# EAGLE schematic motor_controller_logic (EAGLE 6.1)
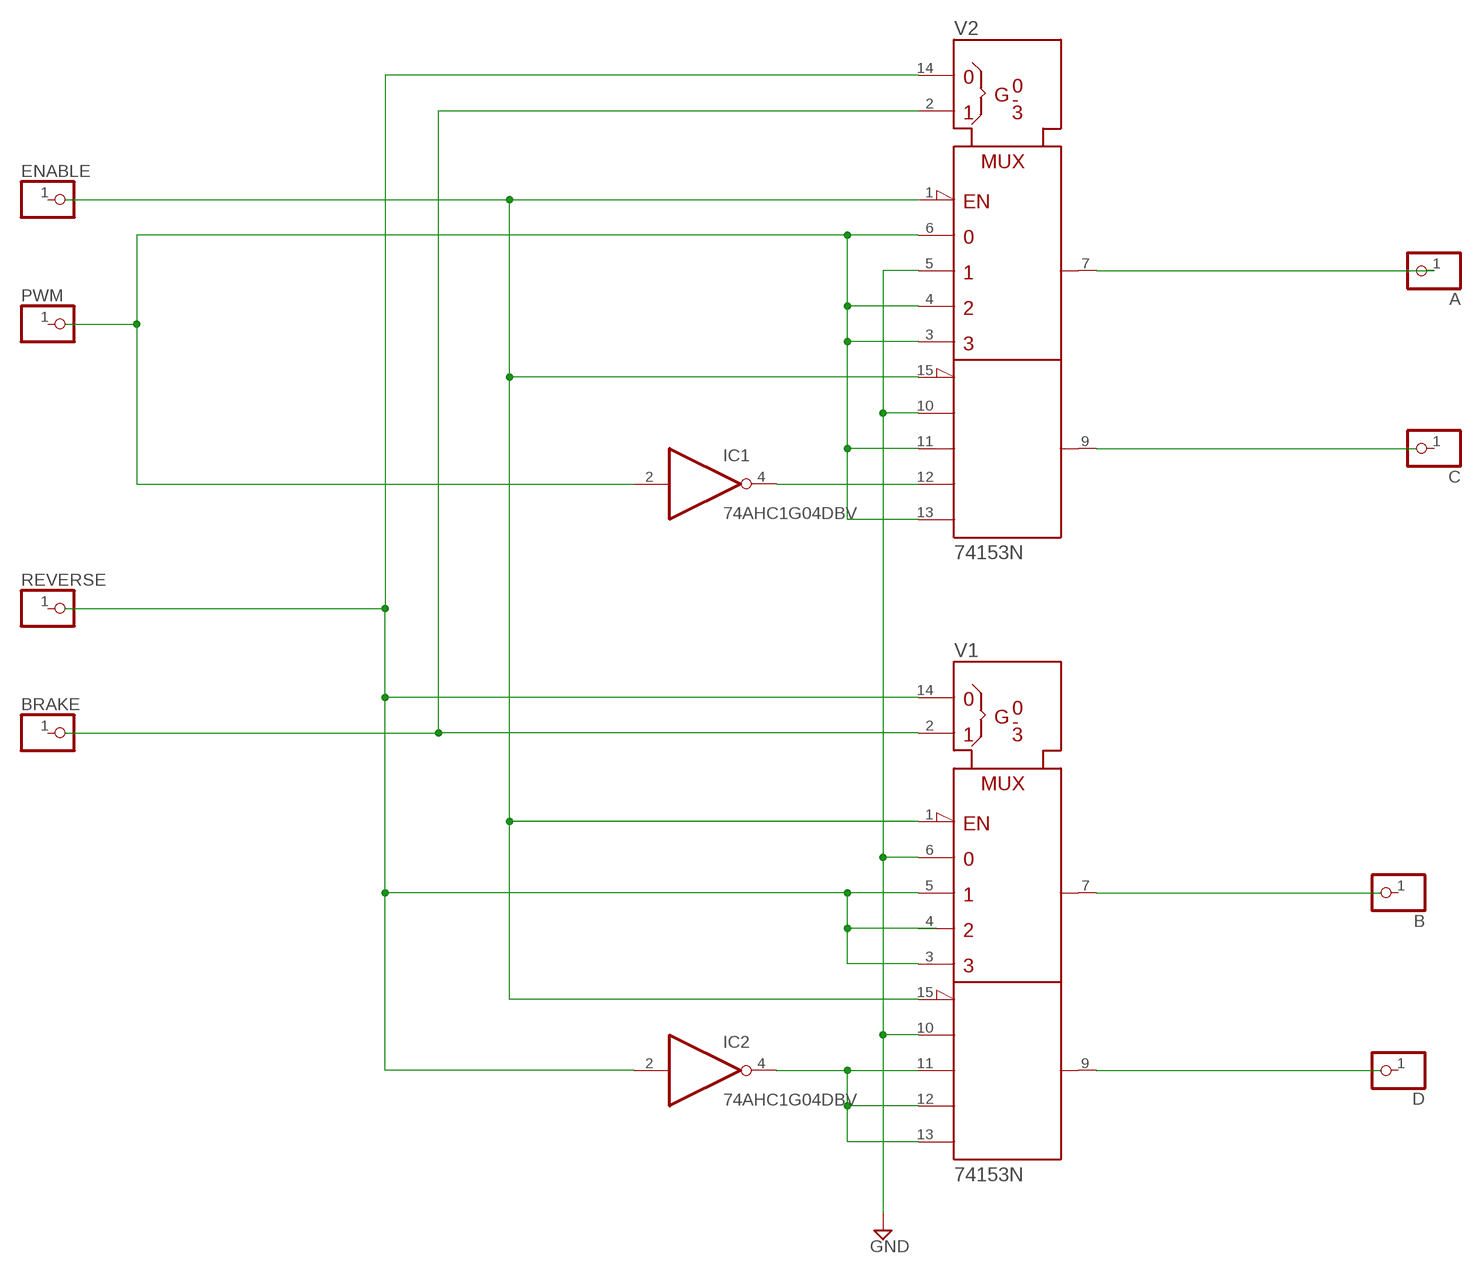
[diagram p0: schematic, sheet 1]

## Parts
A  PINHD-1X1  [1X01]
B  PINHD-1X1  [1X01]
BRAKE  PINHD-1X1  [1X01]
C  PINHD-1X1  [1X01]
D  PINHD-1X1  [1X01]
ENABLE  PINHD-1X1  [1X01]
IC1  74AHC1G04DBV  [SOT23-5]
IC2  74AHC1G04DBV  [SOT23-5]
PWM  PINHD-1X1  [1X01]
REVERSE  PINHD-1X1  [1X01]
V1  74153N  [DIL16]
V2  74153N  [DIL16]

## Nets
GND: V1.6(1C0) V1.10(2C0) V2.5(1C1) V2.10(2C0)
N$1: IC1.2(I) V2.3(1C3) V2.4(1C2) V2.6(1C0) V2.11(2C1) V2.13(2C3)
N$2: IC1.4(O) V2.12(2C2)
N$3: A.1 V2.7(1Y)
N$4: V2.9(2Y)
N$5: V1.7(1Y)
N$6: V1.9(2Y)
N$7: V1.1(!1G) V1.15(!2G) V2.1(!1G) V2.15(!2G)
N$8: V1.2(B) V2.2(B)
N$9: IC2.2(I) V1.3(1C3) V1.5(1C1) V1.14(A) V2.14(A)
N$10: IC2.4(O) V1.11(2C1) V1.12(2C2) V1.13(2C3)
Unconnected: B.1 BRAKE.1 C.1 D.1 ENABLE.1 PWM.1 REVERSE.1 V1.4(1C2)

## Power pins joined to a net without a drawn wire
+UB: V1.16(+UB) V2.16(+UB)
-UB: V1.8(-UB) V2.8(-UB)
GND: IC1.3(GND) IC2.3(GND)
VCC: IC1.5(VCC) IC2.5(VCC)

## Library data of the parts
A B BRAKE C D ENABLE PWM REVERSE = pinhead:PINHD-1X1: PIN HEADER
IC1 IC2 = 74xx-little-us:74*1G04: INVERTER Gate
V1 V2 = 74ttl-din:74*153: Dual 4-line to 1-line data SELECTOR/MULTIPLEXER